# Altium schematic sheet Connector.SchDoc
size A4
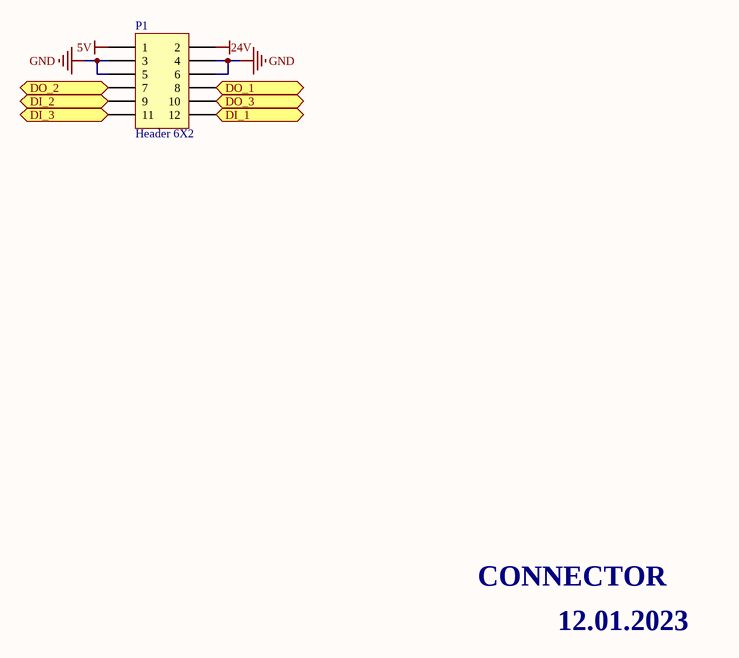
[diagram p0: Connector.SchDoc]

## Parts
P1  Header 6X2  [HDR2X6]

## Ports
DI_1, DI_2, DI_3, DO_1, DO_2, DO_3

## Nets
5V: P1.1
24V: P1.2
GND: P1.3 P1.4 P1.5 P1.6
DI_1: P1.12 ; port DI_1
DI_2: P1.9 ; port DI_2
DI_3: P1.11 ; port DI_3
DO_1: P1.8 ; port DO_1
DO_2: P1.7 ; port DO_2
DO_3: P1.10 ; port DO_3

## Notes on the sheet
- CONNECTOR
- 12.01.2023

## Library data of the parts
P1 = Header 6X2: CONNECTOR Header, 6-Pin, Dual row; LatestRevisionDate: 17-Jul-2002; LatestRevisionNote: Re-released for DXP Platform.; Publisher: Altium Limited